# Altium schematic sheet LDO.SchDoc: Power Sub-board
size Letter; CompanyName: Hello Inc.; DrawnBy: John Kelley; Organization: Hello Inc.; Revision: EVT2; SheetNumber: 6; SheetTotal: 8
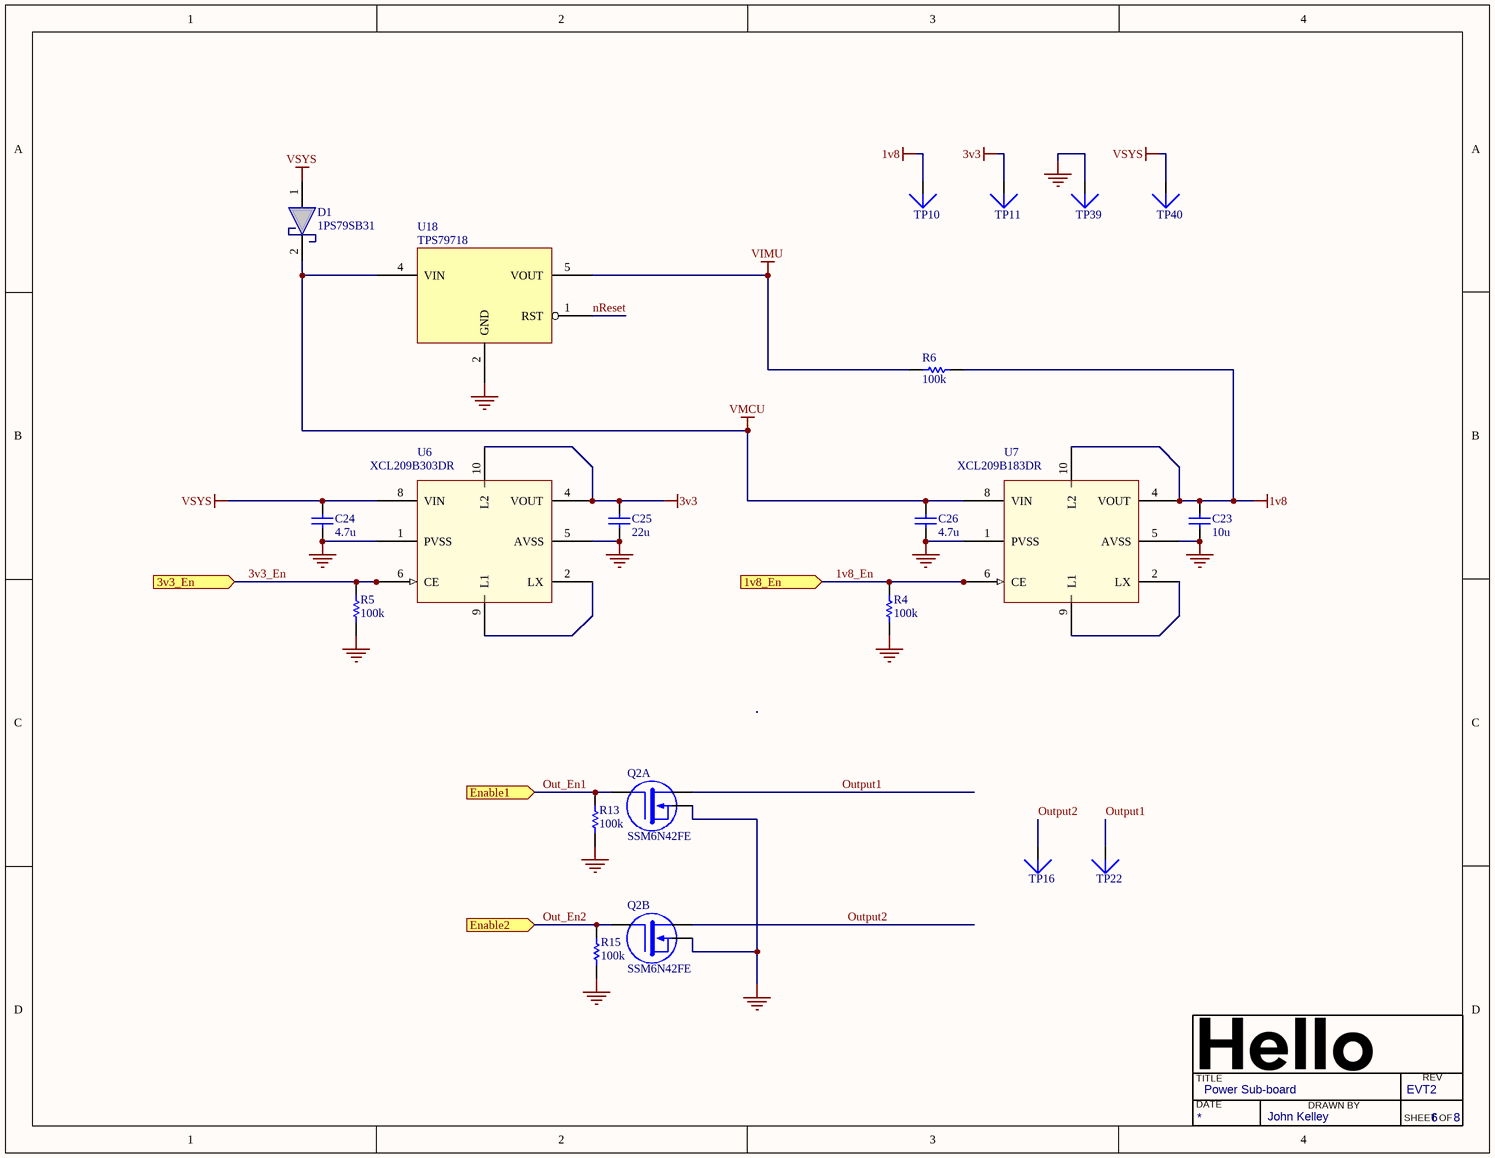
[diagram p0: LDO.SchDoc]

## Parts
C23  10u  [CAP0603]
C24  4.7u  [CAP0402]
C25  22u  [CAP0603]
C26  4.7u  [CAP0402]
D1  1PS79SB31  [SOD-523]
Q2  SSM6N42FE  [ES6]  (parts A,B of 2)
R4  100k  [RES0201]
R5  100k  [RES0201]
R6  100k  [RES0201]
R13  100k  [RES0201]
R15  100k  [RES0201]
TP10  TestPoint  [TP-0.3]  (value not drawn)
TP11  TestPoint  [TP-0.3]  (value not drawn)
TP16  TestPoint  [TP-0.3]  (value not drawn)
TP22  TestPoint  [TP-0.3]  (value not drawn)
TP39  TestPoint  [TP-0.3]  (value not drawn)
TP40  TestPoint  [TP-0.3]  (value not drawn)
U6  XCL209B303DR  [USP-10B03]
U7  XCL209B183DR  [USP-10B03]
U18  TPS79718  [SOT65P212X110-5N]

## Ports
1v8_En (in), 3v3_En (in), Enable1 (in), Enable2 (in)

## Nets
1v8: C23.2 R6.2 TP10.1 U7.4(VOUT) U7.10(L2)
3v3: C25.2 TP11.1 U6.4(VOUT) U6.10(L2)
GND: C23.1 C24.1 C25.1 C26.1 Q2.1(S1) Q2.4(S2) R4.2 R5.1 R13.1 R15.1 TP39.1 U6.1(PVSS) U6.5(AVSS) U7.1(PVSS) U7.5(AVSS) U18.2(GND)
VIMU: R6.1 U18.5(VOUT)
VMCU: C26.2 D1.2(Cathode) U7.8(VIN) U18.4(VIN)
VSYS: C24.2 D1.1(Anode) TP40.1 U6.8(VIN)
1v8_En: R4.1 U7.6(CE) ; port 1v8_En
3v3_En: R5.2 U6.6(CE) ; port 3v3_En
nReset: U18.1(RST)
Out_En1: Q2.2(G1) R13.2 ; port Enable1
Out_En2: Q2.5(G2) R15.2 ; port Enable2
Output1: Q2.6(D1) TP22.1
Output2: Q2.3(D2) TP16.1
NetU6_2: U6.2(LX) U6.9(L1)
NetU7_2: U7.2(LX) U7.9(L1)

## Notes on the sheet
- TITLE
- DATE
- DRAWN BY
- REV
- SHEET
- OF

## Library data of the parts
C23 = C_10u_10_6.3_X5R_0603: Chip capacitor; Vendor: TDK; PN: C1608X5R0J106K080AB; Tolerance: 10%; Voltage: 6.3V; Temp: X5R; Value: 10u; Size: 0603
C24 C26 = C_4.7u_10_10_JB_0402: Chip capacitor; Vendor: TDK; PN: C1005JB1A475K050BC; Tolerance: 10%; Voltage: 10V; Temp: JB; Value: 4.7u; Size: 0402
C25 = C_22u_10_20_JB_0603: Chip capacitor; Vendor: TDK; PN: C1608JB1A226M080AC; Tolerance: 20%; Voltage: 10V; Temp: JB; Value: 22u; Size: 0603
D1 = 1PS79SB31: Schottky diode, 30V 200mA; Vendor: NXP; PN: 1PS79SB31
Q2 = SSM6N42FE: Toshiba Dual N-Channel MOSFET 1.5v drive 20V 800ma
R4-R6 R13 R15 = R_100k_5_0.05_0201: Chip Resistor; Vendor: Panasonic; Tolerance: 5 %; Power: 0.05 W; PN: ERJ-1GEJ104C; Model: *; Value: 100k; Size: 0201
TP10 TP11 TP16 TP22 TP39 TP40 = TestPoint: Generic Test Point
U6 U7 = XCL208: Torex micro DC-DC Converter
U18 = TPS79718DCK: LDO 1.8V SC70-5